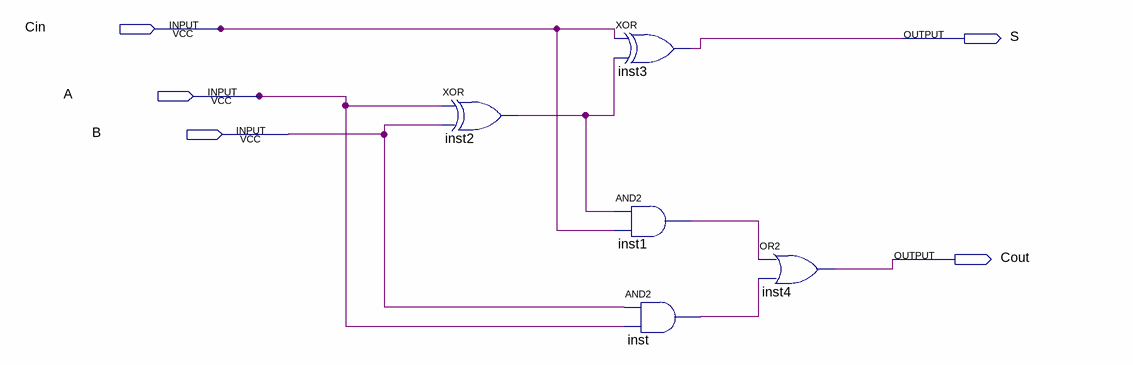
[diagram p0: schematic sheet]
// Quartus schematic fulladder.bdf as structural Verilog: 5 symbols, 5 pins
module fulladder (
  input  Cin,
  input  A,
  input  B,
  output S,
  output Cout
);

  wire inst1_out, inst2_out, inst_out;

  xor inst2 (inst2_out, A, B);
  xor inst3 (S, Cin, inst2_out);
  and inst1 (inst1_out, inst2_out, Cin);
  and inst (inst_out, B, A);
  or inst4 (Cout, inst1_out, inst_out);
endmodule
